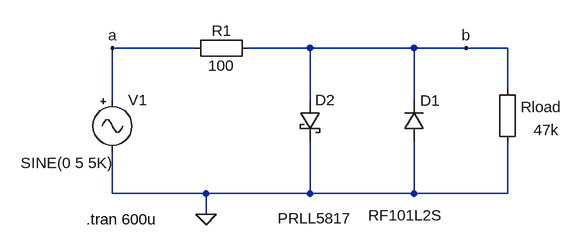
[diagram p0: schematic LD-B6.asc]
LD-B6.asc, the LTspice schematic file:
Version 4
SHEET 1 880 680
WIRE 32 144 -96 144
WIRE 208 144 112 144
WIRE 368 144 208 144
WIRE 448 144 368 144
WIRE 512 144 448 144
WIRE 512 208 512 144
WIRE -96 224 -96 144
WIRE 208 224 208 144
WIRE 368 224 368 144
WIRE -96 368 -96 304
WIRE 48 368 -96 368
WIRE 208 368 208 288
WIRE 208 368 48 368
WIRE 368 368 368 288
WIRE 368 368 208 368
WIRE 512 368 512 288
WIRE 512 368 368 368
WIRE 48 400 48 368
FLAG -96 144 a
FLAG 448 144 b
FLAG 48 400 0
SYMBOL diode 384 288 R180
WINDOW 0 -24 63 Left 2
WINDOW 3 -29 -114 Left 2
SYMATTR InstName D1
SYMATTR Value RF101L2S
SYMBOL Misc\\signal -96 208 R0
WINDOW 123 0 0 Left 2
WINDOW 39 0 0 Left 2
WINDOW 3 -141 113 Left 2
SYMATTR Value SINE(0 5 5K)
SYMATTR InstName V1
SYMBOL Misc\\EuropeanResistor 128 128 R90
WINDOW 0 5 56 VBottom 2
WINDOW 3 27 56 VTop 2
SYMATTR InstName R1
SYMATTR Value 100
SYMBOL schottky 192 224 R0
WINDOW 3 -34 182 Left 2
SYMATTR Value PRLL5817
SYMATTR InstName D2
SYMATTR Description Diode
SYMATTR Type diode
SYMBOL Misc\\EuropeanResistor 528 304 R180
WINDOW 0 -67 69 Left 2
WINDOW 3 -63 34 Left 2
SYMATTR InstName Rload
SYMATTR Value 47k
TEXT -136 408 Left 2 !.tran 600u

The netlist it stands for:
* LD-B6.asc
D1 0 b RF101L2S
V1 a 0 SINE(0 5 5K)
R1 b a 100
D2 b 0 PRLL5817
Rload 0 b 47k
.model D D
.lib standard.dio
.tran 600u
.backanno
.end